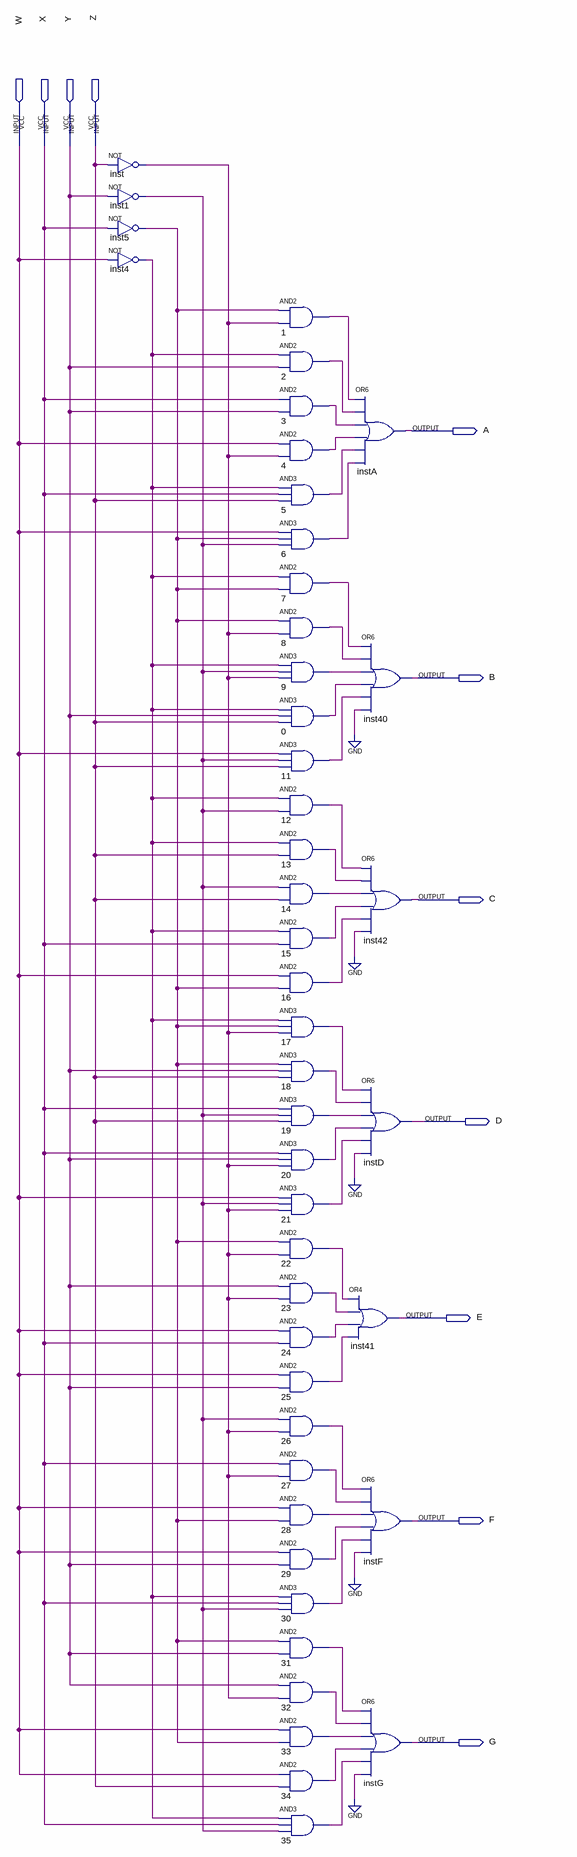
[diagram p0: schematic sheet]
// Quartus schematic HexToSSD.bdf as structural Verilog: 46 symbols, 11 pins
module HexToSSD (
  input  W,
  input  X,
  input  Y,
  input  Z,
  output A,
  output B,
  output C,
  output D,
  output E,
  output F,
  output G
);

  wire inst1_out, inst4_out, inst5_out, inst_out, n0_out, n1_out, n2_out, n3_out, n4_out, n5_out, n6_out,
       n7_out, n8_out, n9_out, n11_out, n12_out, n13_out, n14_out, n15_out, n16_out, n17_out, n18_out,
       n19_out, n20_out, n21_out, n22_out, n23_out, n24_out, n25_out, n26_out, n27_out, n28_out, n29_out,
       n30_out, n31_out, n32_out, n33_out, n34_out, n35_out;

  not inst (inst_out, Z);
  not inst1 (inst1_out, Y);
  not inst5 (inst5_out, X);
  not inst4 (inst4_out, W);
  and u_1 (n1_out, inst5_out, inst_out);
  and u_2 (n2_out, inst4_out, Y);
  and u_3 (n3_out, X, Y);
  and u_4 (n4_out, W, inst_out);
  and u_5 (n5_out, inst4_out, X, Z);
  and u_6 (n6_out, W, inst5_out, inst1_out);
  and u_7 (n7_out, inst4_out, inst5_out);
  and u_8 (n8_out, inst5_out, inst_out);
  and u_9 (n9_out, inst4_out, inst1_out, inst_out);
  and u_0 (n0_out, inst4_out, Y, Z);
  and u_11 (n11_out, W, inst1_out, Z);
  and u_12 (n12_out, inst4_out, inst1_out);
  and u_13 (n13_out, inst4_out, Z);
  and u_14 (n14_out, inst1_out, Z);
  and u_15 (n15_out, inst4_out, X);
  and u_16 (n16_out, W, inst5_out);
  and u_17 (n17_out, inst4_out, inst5_out, inst_out);
  and u_18 (n18_out, inst5_out, Y, Z);
  and u_19 (n19_out, X, inst1_out, Z);
  and u_20 (n20_out, X, Y, inst_out);
  and u_21 (n21_out, W, inst1_out, inst_out);
  and u_22 (n22_out, inst5_out, inst_out);
  and u_23 (n23_out, Y, inst_out);
  and u_24 (n24_out, W, X);
  and u_25 (n25_out, W, Y);
  and u_26 (n26_out, inst1_out, inst_out);
  and u_27 (n27_out, X, inst_out);
  and u_28 (n28_out, W, inst5_out);
  and u_29 (n29_out, W, Y);
  and u_30 (n30_out, inst4_out, X, inst1_out);
  and u_31 (n31_out, inst5_out, Y);
  and u_32 (n32_out, Y, inst_out);
  and u_33 (n33_out, W, inst5_out);
  and u_34 (n34_out, W, Z);
  and u_35 (n35_out, inst4_out, X, inst1_out);
  or instA (A, n1_out, n2_out, n3_out, n4_out, n5_out, n6_out);
  or inst40 (B, n7_out, n8_out, n9_out, n0_out, n11_out, 1'b0);
  or inst42 (C, n12_out, n13_out, n14_out, n15_out, n16_out, 1'b0);
  or instD (D, n17_out, n18_out, n19_out, n20_out, n21_out, 1'b0);
  or inst41 (E, n22_out, n23_out, n24_out, n25_out);
  or instF (F, n26_out, n27_out, n28_out, n29_out, n30_out, 1'b0);
  or instG (G, n31_out, n32_out, n33_out, n34_out, n35_out, 1'b0);
endmodule
